# Altium schematic sheet Peripherals.SchDoc
size A4
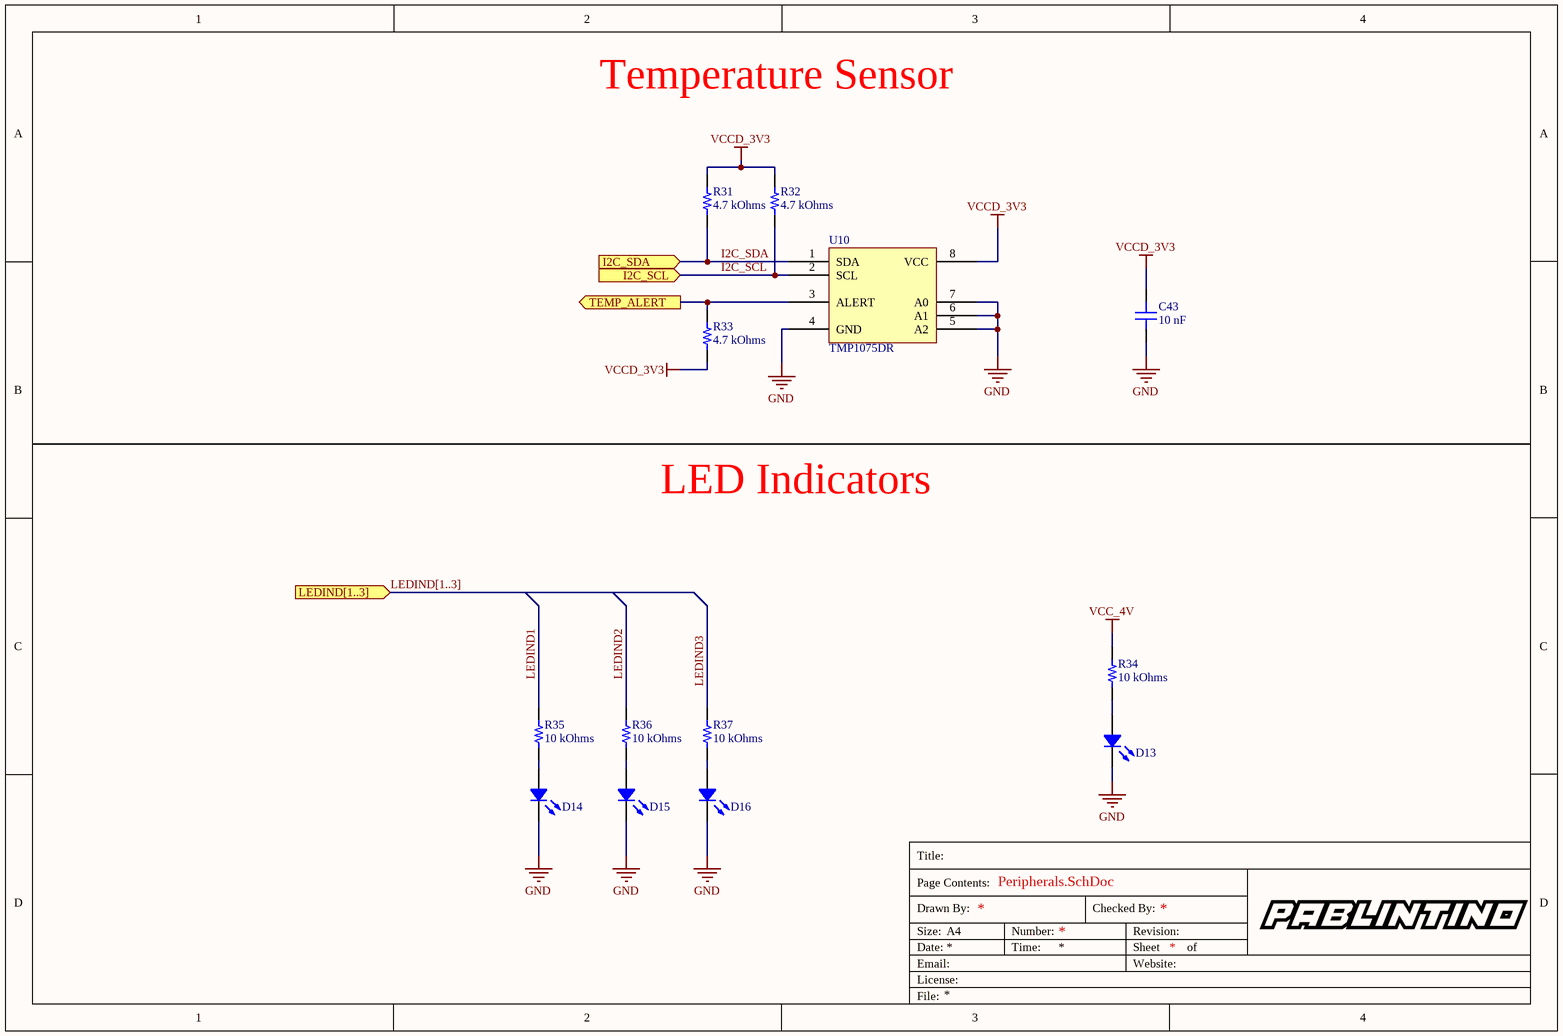
[diagram p0: Peripherals.SchDoc]

## Parts
C43  10 nF  [CAP 0805_2012]
D13  APTD1608LSECK  [LED 0603_1608 RED]  (value not drawn)
D14  APTD1608LZGCK  [LED 0603_1608 GREEN]  (value not drawn)
D15  APTD1608LZGCK  [LED 0603_1608 GREEN]  (value not drawn)
D16  APTD1608LSECK  [LED 0603_1608 RED]  (value not drawn)
R31  4.7 kOhms  [RES 0603_1608]
R32  4.7 kOhms  [RES 0603_1608]
R33  4.7 kOhms  [RES 0603_1608]
R34  10 kOhms  [RES 0603_1608]
R35  10 kOhms  [RES 0603_1608]
R36  10 kOhms  [RES 0603_1608]
R37  10 kOhms  [RES 0603_1608]
U10  TMP1075DR  [SOIC_DDAR_TEX]

## Ports
I2C_SCL (in), I2C_SDA (in), LEDIND[1..3] (in), TEMP_ALERT (out)

## Nets
GND: C43.2 D13.2 D14.2 D15.2 D16.2 U10.4(GND) U10.5(A2) U10.6(A1) U10.7(A0)
VCC_4V: R34.1
VCCD_3V3: C43.1 R31.2 R32.2 R33.1 U10.8(VCC)
I2C_SCL: R32.1 U10.2(SCL) ; port I2C_SCL
I2C_SDA: R31.1 U10.1(SDA) ; port I2C_SDA
LEDIND1: R35.1
LEDIND2: R36.1
LEDIND3: R37.1
TEMP_ALERT: R33.2 U10.3(ALERT) ; port TEMP_ALERT
NetD13_1: D13.1 R34.2
NetD14_1: D14.1 R35.2
NetD15_1: D15.1 R36.2
NetD16_1: D16.1 R37.2

## Buses and harness runs
bus LEDIND[1..3] = port LEDIND[1..3]

## Notes on the sheet
- Temperature Sensor
- LED Indicators
- Title:
- Drawn By:
- Page Contents:
- Checked By:
- Size:
- Date:
- File:
- License:
- Email:
- A4
- Number:
- Time:
- Revision:
- Sheet
- Website:
- of

## Library data of the parts
C43 = C0805C103K5GEC7210: MLCC Ceramic 10 nF 50 V 10% Capacitor; Manufacturer: KEMET; Voltage: 50 V; Type: capacitor_ceramic; Through Hole: 0; Part Number: C0805C103K5GEC7210; Value: 10 nF; Tolerance: 10%; Composition: NP0; Created On: 28/05/2020 20:55:06; Updated On: 28/05/2020 20:58:59; Package: 0805 (2012 Metric)
D13 D16 = APTD1608LSECK: SMD Low Current Red LED; Manufacturer: Kingbright; Gain Bandwith Product: 1.8 V; Input Type: dome; Amplifier Type: clear; Slew Rate: 625 nm; Voltage Supplies: 2 mA; Input Offset Voltage: 0.8 mm x 1.2 mm; Type: led_indicator; Through Hole: 0; Part Number: APTD1608LSECK; Output Type: red; Created On: 28/07/2020 18:43:03; Updated On: 28/07/2020 18:43:38; Package: 0603 (1608 Metric)
D14 D15 = APTD1608LZGCK: SMD Low Current Green LED; Manufacturer: Kingbright; Gain Bandwith Product: 2.65 V; Input Type: dome; Amplifier Type: clear; Slew Rate: 515 nm; Voltage Supplies: 2 mA; Input Offset Voltage: 0.8 mm x 1.2 mm; Type: led_indicator; Through Hole: 0; Part Number: APTD1608LZGCK; Output Type: green; Created On: 28/07/2020 18:40:12; Updated On: 28/07/2020 18:43:35; Package: 0603 (1608 Metric)
R31-R33 = CRCW06034K70FKEAC: Thin Film Resistor 4.7 kOhms 1%; Manufacturer: Vishay / Dale; Power Max: 100 mW; Through Hole: 0; Part Number: CRCW06034K70FKEAC; Value: 4.7 kOhms; Tolerance: 1%; Created On: 28/07/2020 21:42:19; Updated On: 28/07/2020 21:42:52; Type: resistor; Package: 0603 (1608 Metric)
R34-R37 = CRCW060310K0FKEAC: Thin Film Resistor 10 kOhms 1%; Manufacturer: Vishay / Dale; Power Max: 100 mW; Through Hole: 0; Part Number: CRCW060310K0FKEAC; Value: 10 kOhms; Tolerance: 1%; Created On: 22/07/2020 22:08:22; Updated On: 22/07/2020 22:09:01; Type: resistor; Package: 0603 (1608 Metric)
U10 = TMP1075DR: TMP1075 Temperature Sensor With I2C and SMBus Interface; Part Number: TMP1075DR